# Altium schematic sheet FPGA_Bank_0_CFG.SchDoc: =ProjectName
size 420 x 297 mm; Author: T.P.; CompanyName: WUT; DrawnBy: T.P.; Organization: WUT ISE; Address1: Warsaw Univeristy of Technology; Address2: Nowowiejska 15/19; DocumentNumber: 4; Revision: 0.9; SheetNumber: 4; SheetTotal: 36; EDA_Number: ARTIQ; Projet: ARTIQ/SINARA; ModifiedBy: -; CreateDate: XX/XX/XXXX; CheckedDate: -; Title2: FPGA_Bank_0_CFG.SchDoc; DivGrp: ISE; Designer: G.K. and T.P.; ModifiedDate: -; ProjectName: ADC/DAC MEZZANINE
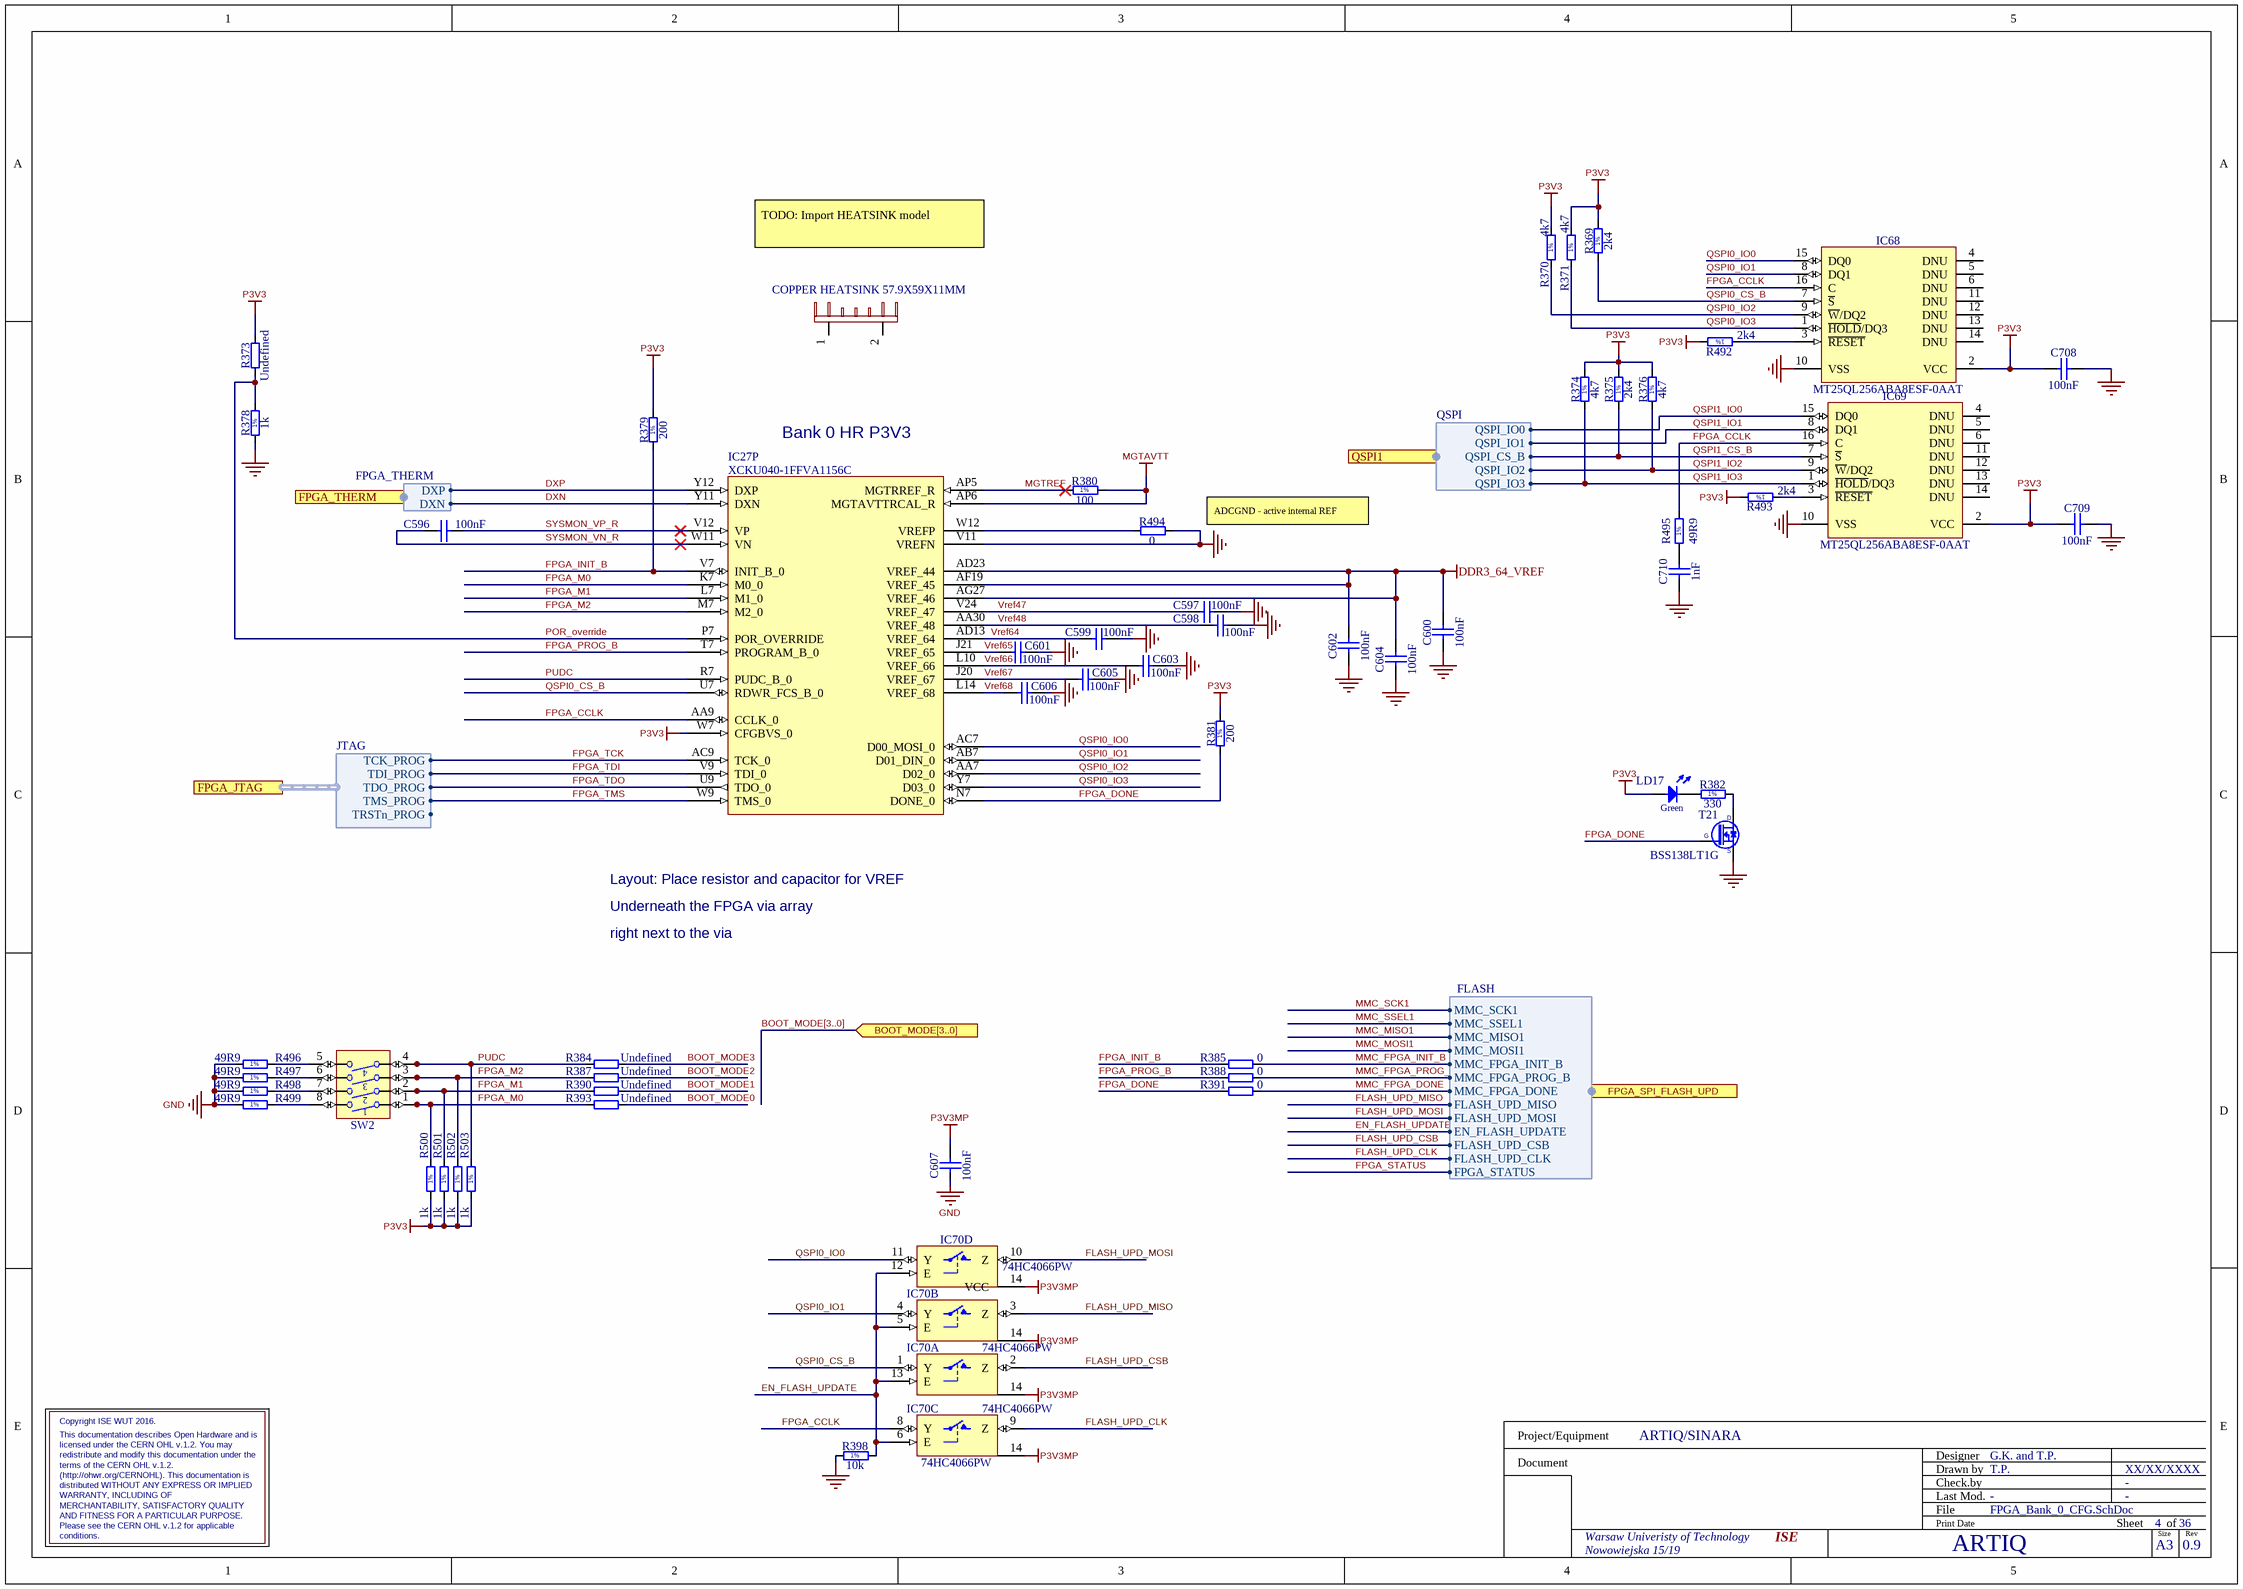
[diagram p0: FPGA_Bank_0_CFG.SchDoc]

## Parts
C596  100nF  [CAPC0603X33N]
C597  100nF  [CAPC0603X33N]
C598  100nF  [CAPC0603X33N]
C599  100nF  [CAPC0603X33N]
C600  100nF  [CAPC0603X33N]
C601  100nF  [CAPC0603X33N]
C602  100nF  [CAPC0603X33N]
C603  100nF  [CAPC0603X33N]
C604  100nF  [CAPC0603X33N]
C605  100nF  [CAPC0603X33N]
C606  100nF  [CAPC0603X33N]
C607  100nF  [CAPC0603X33N]
C708  100nF  [CAPC0603X33N]
C709  100nF  [CAPC0603X33N]
C710  1nF  [CAPC1005X55N]
HS1  Part Description: COPPER HEATSINK 57.9X59X11MM  (hidden comment: 1.9K/W)
IC27  XCKU040-1FFVA1156C  [BGA1156C100P34X34_3500X3500X350]  (part P of 22)
IC68  MT25QL256ABA8ESF-0AAT  [SOIC127P1030X265-16N]
IC69  MT25QL256ABA8ESF-0AAT  [SOIC127P1030X265-16N]
IC70  74HC4066PW  [SOP65P640X110-14N]  (parts A,B,C,D of 4)
LD17  Green  [LED_AVAGO_HSME-C120]
R369  2k4  [RESC1005X40N]
R370  4k7  [RESC1005X40N]
R371  4k7  [RESC1005X40N]
R373  Undefined  [RESC1005X40N]
R374  4k7  [RESC1005X40N]
R375  2k4  [RESC1005X40N]
R376  4k7  [RESC1005X40N]
R378  1k  [RESC1005X40N]
R379  200  [RESC1005X40N]
R380  100  [RESC0603X28N]
R381  200  [RESC1005X40N]
R382  330  [RESC1005X40N]
R384  Undefined  [RESC1005X40N]
R385  0  [RESC1005X40N]
R387  Undefined  [RESC1005X40N]
R388  0  [RESC1005X40N]
R390  Undefined  [RESC1005X40N]
R391  0  [RESC1005X40N]
R393  Undefined  [RESC1005X40N]
R398  10k  [RESC1005X40N]
R492  2k4  [RESC1005X40N]
R493  2k4  [RESC1005X40N]
R494  0  [RESC1005X40N]
R495  49R9  [RESC1005X40N]
R496  49R9  [RESC1005X40N]
R497  49R9  [RESC1005X40N]
R498  49R9  [RESC1005X40N]
R499  49R9  [RESC1005X40N]
R500  1k  [RESC1005X40N]
R501  1k  [RESC1005X40N]
R502  1k  [RESC1005X40N]
R503  1k  [RESC1005X40N]
SW2  Switch  [SW_TYCO_1571983-4]  (value not drawn)
T21  BSS138LT1G  [SOT95P240X110-3N]

## Ports
BOOT_MODE[3..0] (in), FPGA_JTAG (harness JTAG), FPGA_SPI_FLASH_UPD (harness FLASH), FPGA_THERM (harness FPGA_THERM), QSPI1 (harness QSPI)

## Harnesses
JTAG: TDO_PROG, TDI_PROG, TCK_PROG, TMS_PROG, TRSTn_PROG
FPGA_THERM: DXN, DXP
FLASH: MMC_SCK1, MMC_SSEL1, MMC_MISO1, MMC_MOSI1, MMC_FPGA_INIT_B, MMC_FPGA_PROG_B, MMC_FPGA_DONE, FLASH_UPD_MISO, FLASH_UPD_MOSI, EN_FLASH_UPDATE, FLASH_UPD_CSB, FLASH_UPD_CLK, FPGA_STATUS
QSPI: QSPI_IO1, QSPI_IO2, QSPI_IO3, QSPI_IO0, QSPI_CS_B

## Nets
DDR3_64_VREF: C600.1 C602.1 C604.1 IC27.AD23(VREF_44) IC27.AF19(VREF_45) IC27.AG27(VREF_46)
GND: C597.2 C598.2 C599.2 C600.2 C601.2 C602.2 C603.2 C604.2 C605.2 C606.2 C607.1 C708.1 C709.1 C710.1 IC27.V11(VREFN) IC68.10(VSS) IC69.10(VSS) IC70.7(GND) R378.1 R398.1 R494.2 R496.1 R497.1 R498.1 R499.1 T21.2(S)
MGTAVTT: IC27.AP6(MGTAVTTRCAL_R) R380.2
P3V3: C708.2 C709.2 IC27.W7(CFGBVS_0) IC68.2(VCC) IC69.2(VCC) LD17.2(A) R369.2 R370.2 R371.2 R373.2 R374.2 R375.2 R376.2 R379.2 R381.2 R492.2 R493.2 R500.1 R501.1 R502.1 R503.1
P3V3MP: C607.2 IC70.14(VCC)
BOOT_MODE0: R393.2
BOOT_MODE1: R390.2
BOOT_MODE2: R387.2
BOOT_MODE3: R384.2
DXN: IC27.Y11(DXN) ; port FPGA_THERM.DXN
DXP: IC27.Y12(DXP) ; port FPGA_THERM.DXP
EN_FLASH_UPDATE: IC70.5(E) IC70.6(E) IC70.12(E) IC70.13(E) R398.2 ; port FPGA_SPI_FLASH_UPD.EN_FLASH_UPDATE
FLASH_UPD_CLK: IC70.9(Z) ; port FPGA_SPI_FLASH_UPD.FLASH_UPD_CLK
FLASH_UPD_CSB: IC70.2(Z) ; port FPGA_SPI_FLASH_UPD.FLASH_UPD_CSB
FLASH_UPD_MISO: IC70.3(Z) ; port FPGA_SPI_FLASH_UPD.FLASH_UPD_MISO
FLASH_UPD_MOSI: IC70.10(Z) ; port FPGA_SPI_FLASH_UPD.FLASH_UPD_MOSI
FPGA_CCLK: IC27.AA9(CCLK_0) IC68.16(C) IC69.16(C) IC70.8(Y) R495.2
FPGA_DONE: IC27.N7(DONE_0) R381.1 R391.1 T21.1(G)
FPGA_INIT_B: IC27.V7(INIT_B_0) R379.1 R385.1
FPGA_M0: IC27.K7(M0_0) R393.1 R500.2 SW2.1
FPGA_M1: IC27.L7(M1_0) R390.1 R501.2 SW2.2
FPGA_M2: IC27.M7(M2_0) R387.1 R502.2 SW2.3
FPGA_PROG_B: IC27.T7(PROGRAM_B_0) R388.1
FPGA_STATUS: port FPGA_SPI_FLASH_UPD.FPGA_STATUS
FPGA_TCK: IC27.AC9(TCK_0) ; port FPGA_JTAG.TCK_PROG
FPGA_TDI: IC27.V9(TDI_0) ; port FPGA_JTAG.TDI_PROG
FPGA_TDO: IC27.U9(TDO_0) ; port FPGA_JTAG.TDO_PROG
FPGA_TMS: IC27.W9(TMS_0) ; port FPGA_JTAG.TMS_PROG
MGTREF: IC27.AP5(MGTRREF_R) R380.1
MMC_FPGA_DONE: R391.2 ; port FPGA_SPI_FLASH_UPD.MMC_FPGA_DONE
MMC_FPGA_INIT_B: R385.2 ; port FPGA_SPI_FLASH_UPD.MMC_FPGA_INIT_B
MMC_FPGA_PROG_B: R388.2 ; port FPGA_SPI_FLASH_UPD.MMC_FPGA_PROG_B
MMC_MISO1: port FPGA_SPI_FLASH_UPD.MMC_MISO1
MMC_MOSI1: port FPGA_SPI_FLASH_UPD.MMC_MOSI1
MMC_SCK1: port FPGA_SPI_FLASH_UPD.MMC_SCK1
MMC_SSEL1: port FPGA_SPI_FLASH_UPD.MMC_SSEL1
POR_override: IC27.P7(POR_OVERRIDE) R373.1 R378.2
PUDC: IC27.R7(PUDC_B_0) R384.1 R503.2 SW2.4
QSPI0_CS_B: IC27.U7(RDWR_FCS_B_0) IC68.7(~{S}) IC70.1(Y) R369.1
QSPI0_IO0: IC27.AC7(D00_MOSI_0) IC68.15(DQ0) IC70.11(Y)
QSPI0_IO1: IC27.AB7(D01_DIN_0) IC68.8(DQ1) IC70.4(Y)
QSPI0_IO2: IC27.AA7(D02_0) IC68.9(~{W}/DQ2) R370.1
QSPI0_IO3: IC27.Y7(D03_0) IC68.1(~{HOLD}/DQ3) R371.1
QSPI1_CS_B: IC69.7(~{S}) R375.1 ; port QSPI1.QSPI_CS_B
QSPI1_IO0: IC69.15(DQ0) ; port QSPI1.QSPI_IO0
QSPI1_IO1: IC69.8(DQ1) ; port QSPI1.QSPI_IO1
QSPI1_IO2: IC69.9(~{W}/DQ2) R376.1 ; port QSPI1.QSPI_IO2
QSPI1_IO3: IC69.1(~{HOLD}/DQ3) R374.1 ; port QSPI1.QSPI_IO3
SYSMON_VN_R: C596.1 IC27.W11(VN)
SYSMON_VP_R: C596.2 IC27.V12(VP)
Vref47: C597.1 IC27.V24(VREF_47)
Vref48: C598.1 IC27.AA30(VREF_48)
Vref64: C599.1 IC27.AD13(VREF_64)
Vref65: C601.1 IC27.J21(VREF_65)
Vref66: C603.1 IC27.L10(VREF_66)
Vref67: C605.1 IC27.J20(VREF_67)
Vref68: C606.1 IC27.L14(VREF_68)
NetC710_2: C710.2 R495.1
NetIC27_W12: IC27.W12(VREFP) R494.1
NetIC68_3: IC68.3(~{RESET}) R492.1
NetIC69_3: IC69.3(~{RESET}) R493.1
NetLD17_1: LD17.1(C) R382.1
NetR382_2: R382.2 T21.3(D)
NetR496_2: R496.2 SW2.5
NetR497_2: R497.2 SW2.6
NetR498_2: R498.2 SW2.7
NetR499_2: R499.2 SW2.8

Not connected (* = marked no-connect by the designer): HS1 1(MOUNT1) 2(MOUNT2); IC68 4(DNU) 5(DNU) 6(DNU) 11(DNU) 12(DNU) 13(DNU) 14(DNU); IC69 4(DNU) 5(DNU) 6(DNU) 11(DNU) 12(DNU) 13(DNU) 14(DNU)

## Buses and harness runs
bus BOOT_MODE[3..0] = port BOOT_MODE[3..0]

## Notes on the sheet
- TODO: Import HEATSINK model
- (near IC27) Bank 0 HR P3V3
- (near R494) ADCGND - active internal REF
- Layout: Place resistor and capacitor for VREF
- right next to the via
- Underneath the FPGA via array
- terms of the CERN OHL v.1.2.
- (http://ohwr.org/CERNOHL). This documentation is
- redistribute and modify this documentation under the
- distributed WITHOUT ANY EXPRESS OR IMPLIED
- This documentation describes Open Hardware and is
- licensed under the CERN OHL v.1.2. You may
- Copyright ISE WUT 2016.
- AND FITNESS FOR A PARTICULAR PURPOSE.
- conditions.
- MERCHANTABILITY, SATISFACTORY QUALITY
- WARRANTY, INCLUDING OF
- Please see the CERN OHL v.1.2 for applicable
- Project/Equipment
- Document
- Designer
- Drawn by
- Check.by
- File
- Last Mod.
- Print Date
- Sheet
- Size
- A3
- of
- Rev
- (in symbol R0201_100R_1%_0.05W_200PPM) 1%
- (in symbol R0402_1K_1%_0.0625W_100PPM) 1%
- (in symbol R0402_2K4_1%_0.0625W_100PPM) 1%
- (in symbol R0402_4K7_1%_0.0625W_100PPM) 1%
- (in symbol R0402_10K_1%_0.0625W_100PPM) 1%
- (in symbol R0402_49R9_1%_0.0625W_100PPM) 1%
- (in symbol R0402_200R_1%_0.0625W_100PPM) 1%
- (in symbol R0402_330R_1%_0.0625W_100PPM) 1%

## Library data of the parts
C596-C606 C708 C709 = CC0201_100NF_6.3V_10%_X5R: Non-polarised capacitor; Manufacturer: GENERIC; Part Description: SMD Multilayer Chip Ceramic Capacitor; Manufacturer1 Part Number: 02016D104KAT2A; Tolerance: ±10%; Voltage: 6.3V; TC: X5R; Manufacturer Part Number: CC0201_100NF_6.3V_10%_X5R; Part Number: CC0201_100NF_6.3V_10%_X5R; Value: 100nF; Component Kind: Standard; Component Type: Standard; Pin Count: 2; Status: Not Recommended; Case: 0201; Mounted: Yes; Socket: No; SMD: Yes; Sense: No; Manufacturer1 Example: AVX; Manufacturer1 ComponentHeight: 0.33mm; HelpURL: \\cern.ch\dfs\Applications\Altium\Datasheets\CC0201_X5R_AVX.pdf; Author: CERN DEM JLC; CreateDate: 03.12.2007; LatestRevisionDate: 03.12.2007
C607 = CC0201_100NF_6.3V_10%_X5R: Non-polarised capacitor; Manufacturer: GENERIC; Manufacturer1 Part Number: 02016D104KAT2A; Part Description: SMD Multilayer Chip Ceramic Capacitor; TC: X5R; Tolerance: ±10%; Voltage: 6.3V; Author: CERN DEM JLC; Case: 0201; Component Kind: Standard; Component Type: Standard; CreateDate: 03.12.2007; HelpURL: \\cern.ch\dfs\Applications\Altium\Datasheets\CC0201_X5R_AVX.pdf; LatestRevisionDate: 03.12.2007; Manufacturer Part Number: CC0201_100NF_6.3V_10%_X5R; Manufacturer1 ComponentHeight: 0.33mm; Manufacturer1 Example: AVX; Mounted: Yes; Part Number: CC0201_100NF_6.3V_10%_X5R; Pin Count: 2; SMD: Yes; Socket: No; Status: Not Recommended; Value: 100nF; Sense: No
C710 = CC0402_1NF_50V_10%_X7R: Non-polarised capacitor; Manufacturer: GENERIC; Part Description: SMD Multilayer Chip Ceramic Capacitor; Manufacturer1 Part Number: 223858715623; Tolerance: ±10%; Voltage: 50V; TC: X7R; Manufacturer Part Number: CC0402_1NF_50V_10%_X7R; Part Number: CC0402_1NF_50V_10%_X7R; Value: 1nF; Component Kind: Standard; Component Type: Standard; Pin Count: 2; Status: Not Recommended; Case: 0402; Mounted: Yes; Socket: No; SMD: Yes; Sense: No; Manufacturer1 Example: PHYCOMP; Manufacturer1 ComponentHeight: 0.55mm; HelpURL: \\cern.ch\dfs\Applications\Altium\Datasheets\CC0402_X7R_PHYCOMP.pdf; Author: CERN DEM JLC; CreateDate: 03.12.2007; LatestRevisionDate: 03.12.2007
HS1 = HSINK_AAVID_342947: Manufacturer: Aavid Thermalloy; $$Internal_Resolution: 00001mm; $$NotCommonProperty_Device: 342947; Cell Name: HS_AAVID_342947; CmpIndex: 1139; DXDB_LIBNAME: MISC_GK; Ref Designator: HS1; SymIndex: 1784; $$Internal___BlkDate: 23:37:56_12-26-16; Footprint: HS_AAVID_342947; Manufacturer Part Number: 342947; Part Name: HSINK_AAVID_342947; Part Number: HSINK_AAVID_342947; Value: 1.9K/W; Orientation: 0 = 0
IC27 = XCKU040-1FFVA1156C: Kintex UltraScale FPGA, 520 I/O, 530K Cells, 1156-Ball BGA, Speed Grade 1, Commercial Grade; Manufacturer: XILINX; Part Description: Kintex UltraScale, 40 DLL I/O, 416 HP I/O, 104 HR I/O, 1156-Pin BGA, Speed Grade 1, Commercial Grade; PressFit: No; Bonding: No; Manufacturer Part Number: XCKU040-1FFVA1156C; PackageDescription: BGA, 1.00mm Pitch, Square; 1156 Pin, 34 Columns X 34 Rows, Body 35.00mm X 35.00mm X 3.50mm H, IPC Medium Density; Part Number: XCKU040-1FFVA1156C; Component Kind: Standard; Component Type: Standard; Device: XCKU040-1FFVA1156C; Pin Count: 1156; Case: BGA1156; Mounted: Yes; Socket: No; SMD: Yes; Sense: No; ComponentHeight: 3.5mm; HelpURL: \\cern.ch\dfs\Applications\Altium\Datasheets\XCKU040-1FFVA1156C.pdf; ComponentLink1URL: \\cern.ch\dfs\Applications\Altium\Datasheets\XCKU040-1FFVA1156C_Package-Pinout.pdf; ComponentLink1Description: Package/Pinout; Author: CERN DEM CA; CreateDate: 16.08.2016; LatestRevisionDate: 16.08.2016
IC68 IC69 = MT25QL256ABA8ESF-0AAT: 256Mbit (32MB), 2.7V-3.6V, Multiple I/O Serial NOR Flash Memory,with Reset# & Hold#; Part Description: 256Mbit (32MB), 2.7V-3.6V, Multiple I/O Serial NOR Flash Memory,with Reset# & Hold# (Automotive grade AEC-Q100); Manufacturer: MICRON TECHNOLOGY; PressFit: No; Bonding: No; Part Number: MT25QL256ABA8ESF-0AAT; Component Kind: Standard; Component Type: Standard; Device: MT25QL256ABA8ESF-0AAT; PackageDescription: SOIC 16, Pitch 1.27mm - Body 7.5x10.3mm, IPC Medium Density; Manufacturer Part Number: MT25QL256ABA8ESF-0AAT; Pin Count: 16; Case: SOIC16; Mounted: Yes; Socket: No; SMD: Yes; Sense: No; ComponentHeight: 2.65mm; HelpURL: \\cern.ch\dfs\Applications\Altium\Datasheets\MT25QL256ABA8ESF-0AAT.pdf; Author: CERN DEM JLC; CreateDate: 05.11.2018; LatestRevisionDate: 05.11.2018
IC70 = 74HC4066PW: Manufacturer: NXP SEMICONDUCTORS; Part Description: Quad Single-Pole Single-Throw Analog Switch; PressFit: No; Bonding: No; Manufacturer Part Number: 74HC4066PW; PackageDescription: SOP, 14-Leads, Body 4.4x5mm (max), Pitch 0.65mm, IPC Medium Density; Part Number: 74HC4066PW; Component Kind: Standard; Component Type: Standard; Device: 74HC4066PW; Pin Count: 14; Case: TSSOP14; Mounted: Yes; Socket: No; SMD: Yes; Sense: No; ComponentHeight: 1.1mm; Author: CERN DEM JLC; HelpURL: \\cern.ch\dfs\Applications\Altium\Datasheets\74HC4066PW.pdf; CreateDate: 19.11.2014; LatestRevisionDate: 19.11.2014
LD17 = LED_AVAGO_HSME-C120: LED Green 1C 2A; Manufacturer: AVAGO TECHNOLOGIES; Part Description: High Performance Right Angle Chip Green LED; PressFit: No; Bonding: No; Manufacturer Part Number: HSME-C120; PackageDescription: Green Chip LED, 2-Leads, Body 1.7x1.1mm, Side Emitting Package; Part Number: LED_AVAGO_HSME-C120; Component Kind: Standard; Component Type: Standard; Color: Green; Pin Count: 2; Mounted: Yes; Socket: No; SMD: Yes; Sense: No; ComponentHeight: 0.7mm; HelpURL: \\cern.ch\dfs\Applications\Altium\Datasheets\LED_AVAGO_HSME-C120.pdf; ComponentLink1URL: \\cern.ch\dfs\Applications\Altium\Datasheets\LED_AVAGO_HSME-C110_DESIGN-GUIDE.pdf; ComponentLink1Description: Design Guide; Author: CERN DEM JMW; CreateDate: 22.07.2009; LatestRevisionDate: 20.06.2012
R369 R375 R492 R493 = R0402_2K4_1%_0.0625W_100PPM: Resistor - 1%; Manufacturer: GENERIC; Part Description: General Purpose Thick Film Chip Resistor; Manufacturer1 Part Number: 232270672402L; TC: ±100ppm/°C; PressFit: No; Manufacturer Part Number: R0402_2K4_1%_0.0625W_100PPM; Part Number: R0402_2K4_1%_0.0625W_100PPM; Tolerance: ±1%; Value: 2k4; Component Kind: Standard; Component Type: Standard; Pin Count: 2; Status: Not Recommended; Power: 0.0625W; Case: 0402; Mounted: Yes; Sense: No; Socket: No; SMD: Yes; Manufacturer1 Example: YAGEO PHYCOMP; Manufacturer1 ComponentHeight: 0.4mm; HelpURL: \\cern.ch\dfs\Applications\Altium\Datasheets\R0402_Phycomp_RC0402.pdf; Author: CERN DEM JLC; CreateDate: 03.12.2007; LatestRevisionDate: 17.10.2012
R370 R371 R374 R376 = R0402_4K7_1%_0.0625W_100PPM: Resistor - 1%; Manufacturer: GENERIC; Part Description: General Purpose Thick Film Chip Resistor; Manufacturer1 Part Number: 232270674702L; TC: ±100ppm/°C; PressFit: No; Manufacturer Part Number: R0402_4K7_1%_0.0625W_100PPM; Part Number: R0402_4K7_1%_0.0625W_100PPM; Tolerance: ±1%; Value: 4k7; Component Kind: Standard; Component Type: Standard; Pin Count: 2; Status: Not Recommended; Power: 0.0625W; Case: 0402; Mounted: Yes; Sense: No; Socket: No; SMD: Yes; Manufacturer1 Example: YAGEO PHYCOMP; Manufacturer1 ComponentHeight: 0.4mm; HelpURL: \\cern.ch\dfs\Applications\Altium\Datasheets\R0402_Phycomp_RC0402.pdf; Author: CERN DEM JLC; CreateDate: 03.12.2007; LatestRevisionDate: 17.10.2012
R373 R384 R387 R390 R393 = R0402_NO-VALUE: Resistor; Part Description: Reserved Footprint For a 0402 (1005) Chip Resistor; PressFit: No; Mounted: No; Manufacturer Part Number: R0402_NO-VALUE; Manufacturer: Undefined; Part Number: R0402_NO-VALUE; Value: Undefined; Component Kind: Standard; Component Type: Standard; Pin Count: 2; Status: None; Case: 0402; Sense: No; Socket: No; SMD: Yes; Manufacturer1 Example: Undefined; Manufacturer1 Part Number: Undefined; Manufacturer1 ComponentHeight: Undefined; HelpURL: Undefined; Author: CERN DEM JLC; CreateDate: 03.12.2007; LatestRevisionDate: 13.03.2008
R378 R500-R503 = R0402_1K_1%_0.0625W_100PPM: Resistor - 1%; Manufacturer: GENERIC; Part Description: General Purpose Thick Film Chip Resistor; Manufacturer1 Part Number: 232270671002L; TC: ±100ppm/°C; PressFit: No; Manufacturer Part Number: R0402_1K_1%_0.0625W_100PPM; Part Number: R0402_1K_1%_0.0625W_100PPM; Tolerance: ±1%; Value: 1k; Component Kind: Standard; Component Type: Standard; Pin Count: 2; Status: Not Recommended; Power: 0.0625W; Case: 0402; Mounted: Yes; Sense: No; Socket: No; SMD: Yes; Manufacturer1 Example: YAGEO PHYCOMP; Manufacturer1 ComponentHeight: 0.4mm; HelpURL: \\cern.ch\dfs\Applications\Altium\Datasheets\R0402_Phycomp_RC0402.pdf; Author: CERN DEM JLC; CreateDate: 03.12.2007; LatestRevisionDate: 17.10.2012
R379 R381 = R0402_200R_1%_0.0625W_100PPM: Resistor - 1%; Manufacturer: GENERIC; Part Description: General Purpose Thick Film Chip Resistor; Manufacturer1 Part Number: 232270672001L; TC: ±100ppm/°C; PressFit: No; Manufacturer Part Number: R0402_200R_1%_0.0625W_100PPM; Part Number: R0402_200R_1%_0.0625W_100PPM; Tolerance: ±1%; Value: 200; Component Kind: Standard; Component Type: Standard; Pin Count: 2; Status: Not Recommended; Power: 0.0625W; Case: 0402; Mounted: Yes; Sense: No; Socket: No; SMD: Yes; Manufacturer1 Example: YAGEO PHYCOMP; Manufacturer1 ComponentHeight: 0.4mm; HelpURL: \\cern.ch\dfs\Applications\Altium\Datasheets\R0402_Phycomp_RC0402.pdf; Author: CERN DEM JLC; CreateDate: 03.12.2007; LatestRevisionDate: 17.10.2012
R380 = R0201_100R_1%_0.05W_200PPM: Resistor - 1%; Manufacturer: GENERIC; Part Description: Thick Film Chip Resistor; Manufacturer1 Part Number: CRCW0201100RFNED; Power: 0.05W; TC: ±200ppm/°C; PressFit: No; Manufacturer Part Number: R0201_100R_1%_0.05W_200PPM; Part Number: R0201_100R_1%_0.05W_200PPM; Tolerance: ±1%; Value: 100; Component Kind: Standard; Component Type: Standard; Pin Count: 2; Status: Not Recommended; Case: 0201; Mounted: Yes; Sense: No; Socket: No; SMD: Yes; Manufacturer1 Example: VISHAY; Manufacturer1 ComponentHeight: 0.27mm; HelpURL: \\cern.ch\dfs\Applications\Altium\Datasheets\R0201_VISHAY_CRCW e3.pdf; Author: CERN DEM JLC; CreateDate: 13.11.2014; LatestRevisionDate: 13.11.2014
R382 = R0402_330R_1%_0.0625W_100PPM: Resistor - 1%; Manufacturer: GENERIC; Part Description: General Purpose Thick Film Chip Resistor; Manufacturer1 Part Number: 232270673301L; TC: ±100ppm/°C; PressFit: No; Manufacturer Part Number: R0402_330R_1%_0.0625W_100PPM; Part Number: R0402_330R_1%_0.0625W_100PPM; Tolerance: ±1%; Value: 330; Component Kind: Standard; Component Type: Standard; Pin Count: 2; Status: Not Recommended; Power: 0.0625W; Case: 0402; Mounted: Yes; Sense: No; Socket: No; SMD: Yes; Manufacturer1 Example: YAGEO PHYCOMP; Manufacturer1 ComponentHeight: 0.4mm; HelpURL: \\cern.ch\dfs\Applications\Altium\Datasheets\R0402_Phycomp_RC0402.pdf; Author: CERN DEM JLC; CreateDate: 03.12.2007; LatestRevisionDate: 17.10.2012
R385 R388 R391 R494 = R0402_0R_JUMPER: Resistor; Manufacturer: GENERIC; Part Description: 1A (0.05R Max DC Resistance) Zero Ohm Jumper; Manufacturer1 Part Number: 232270591001L; PressFit: No; Manufacturer Part Number: R0402_0R_JUMPER; Part Number: R0402_0R_JUMPER; Value: 0; Component Kind: Standard; Component Type: Standard; Pin Count: 2; Status: Not Recommended; Case: 0402; Mounted: Yes; Sense: No; Socket: No; SMD: Yes; Manufacturer1 Example: YAGEO PHYCOMP; Manufacturer1 ComponentHeight: 0.4mm; HelpURL: \\cern.ch\dfs\Applications\Altium\Datasheets\R0402_Phycomp_RC0402.pdf; Author: CERN DEM JLC; CreateDate: 03.12.2007; LatestRevisionDate: 17.10.2012
R398 = R0402_10K_1%_0.0625W_100PPM: Resistor - 1%; Manufacturer: GENERIC; Part Description: General Purpose Thick Film Chip Resistor; Manufacturer1 Part Number: 232270671003L; TC: ±100ppm/°C; PressFit: No; Manufacturer Part Number: R0402_10K_1%_0.0625W_100PPM; Part Number: R0402_10K_1%_0.0625W_100PPM; Tolerance: ±1%; Value: 10k; Component Kind: Standard; Component Type: Standard; Pin Count: 2; Status: Not Recommended; Power: 0.0625W; Case: 0402; Mounted: Yes; Sense: No; Socket: No; SMD: Yes; Manufacturer1 Example: YAGEO PHYCOMP; Manufacturer1 ComponentHeight: 0.4mm; HelpURL: \\cern.ch\dfs\Applications\Altium\Datasheets\R0402_Phycomp_RC0402.pdf; Author: CERN DEM JLC; CreateDate: 03.12.2007; LatestRevisionDate: 17.10.2012
R495-R499 = R0402_49R9_1%_0.0625W_100PPM: Resistor - 1%; Manufacturer: GENERIC; Part Description: General Purpose Thick Film Chip Resistor; Manufacturer1 Part Number: 232270674999L or RC0402FR-0749R9L; TC: ±100ppm/°C; PressFit: No; Manufacturer Part Number: R0402_49R9_1%_0.0625W_100PPM; Part Number: R0402_49R9_1%_0.0625W_100PPM; Tolerance: ±1%; Value: 49R9; Component Kind: Standard; Component Type: Standard; Pin Count: 2; Status: Not Recommended; Power: 0.0625W; Case: 0402; Mounted: Yes; Sense: No; Socket: No; SMD: Yes; Manufacturer1 Example: YAGEO PHYCOMP; Manufacturer1 ComponentHeight: 0.4mm; HelpURL: \\cern.ch\dfs\Applications\Altium\Datasheets\R0402_Phycomp_RC0402.pdf; Author: CERN DEM JLC; CreateDate: 24.10.2012; LatestRevisionDate: 24.10.2012
SW2 = SW_TYCO_1571983-4: 4 Ways SPST DIP Switch; Manufacturer Part Number: 1571983-4 or GDH04S04; Manufacturer: TYCO; Part Description: 4 Way SPST SMD DIP Switch, Latched, Contact Rating 0.025A 24VDC; PressFit: No; PackageDescription: Pitch 1.27mm,  Body 6.2x6.2mm, 4 Ways SPST Surface-Mount DIP Switch, TYCO GDH Series; Part Number: SW_TYCO_1571983-4; Component Kind: Standard; Component Type: Standard; Pin Count: 8; Family: Switch; Mounted: Yes; Socket: No; SMD: Yes; Sense: No; Status: None; ComponentHeight: 2.31mm; HelpURL: \\cern.ch\dfs\Applications\Altium\Datasheets\SW_TYCO_1571983-4.pdf; Author: CERN DEM JLC; CreateDate: 08.01.2009; LatestRevisionDate: 08.01.2009
T21 = BSS138LT1G: N-CHANNEL MOSFET WITH DIODE; Manufacturer: ON SEMICONDUCTOR; Part Description: 50V 200mA N-Channel Enhancement Mode Field-Effect Transistor; PressFit: No; Bonding: No; Manufacturer Part Number: BSS138LT1G; PackageDescription: SOT23 3-Leads, Pitch 0.95mm - Body 1.4x3mm, IPC Medium Density; Part Number: BSS138LT1G; Component Kind: Standard; Component Type: Standard; Device: BSS138LT1G; Pin Count: 3; Case: SOT23-3; Mounted: Yes; Socket: No; SMD: Yes; Sense: No; ComponentHeight: 1.11mm; HelpURL: \\cern.ch\dfs\Applications\Altium\Datasheets\BSS138LT1G.pdf; Author: CERN DEM JLC; CreateDate: 23.03.2009; LatestRevisionDate: 23.03.2009